# Altium schematic sheet Power_Card.SchDoc
size Letter; SheetNumber: 1; SheetTotal: 4
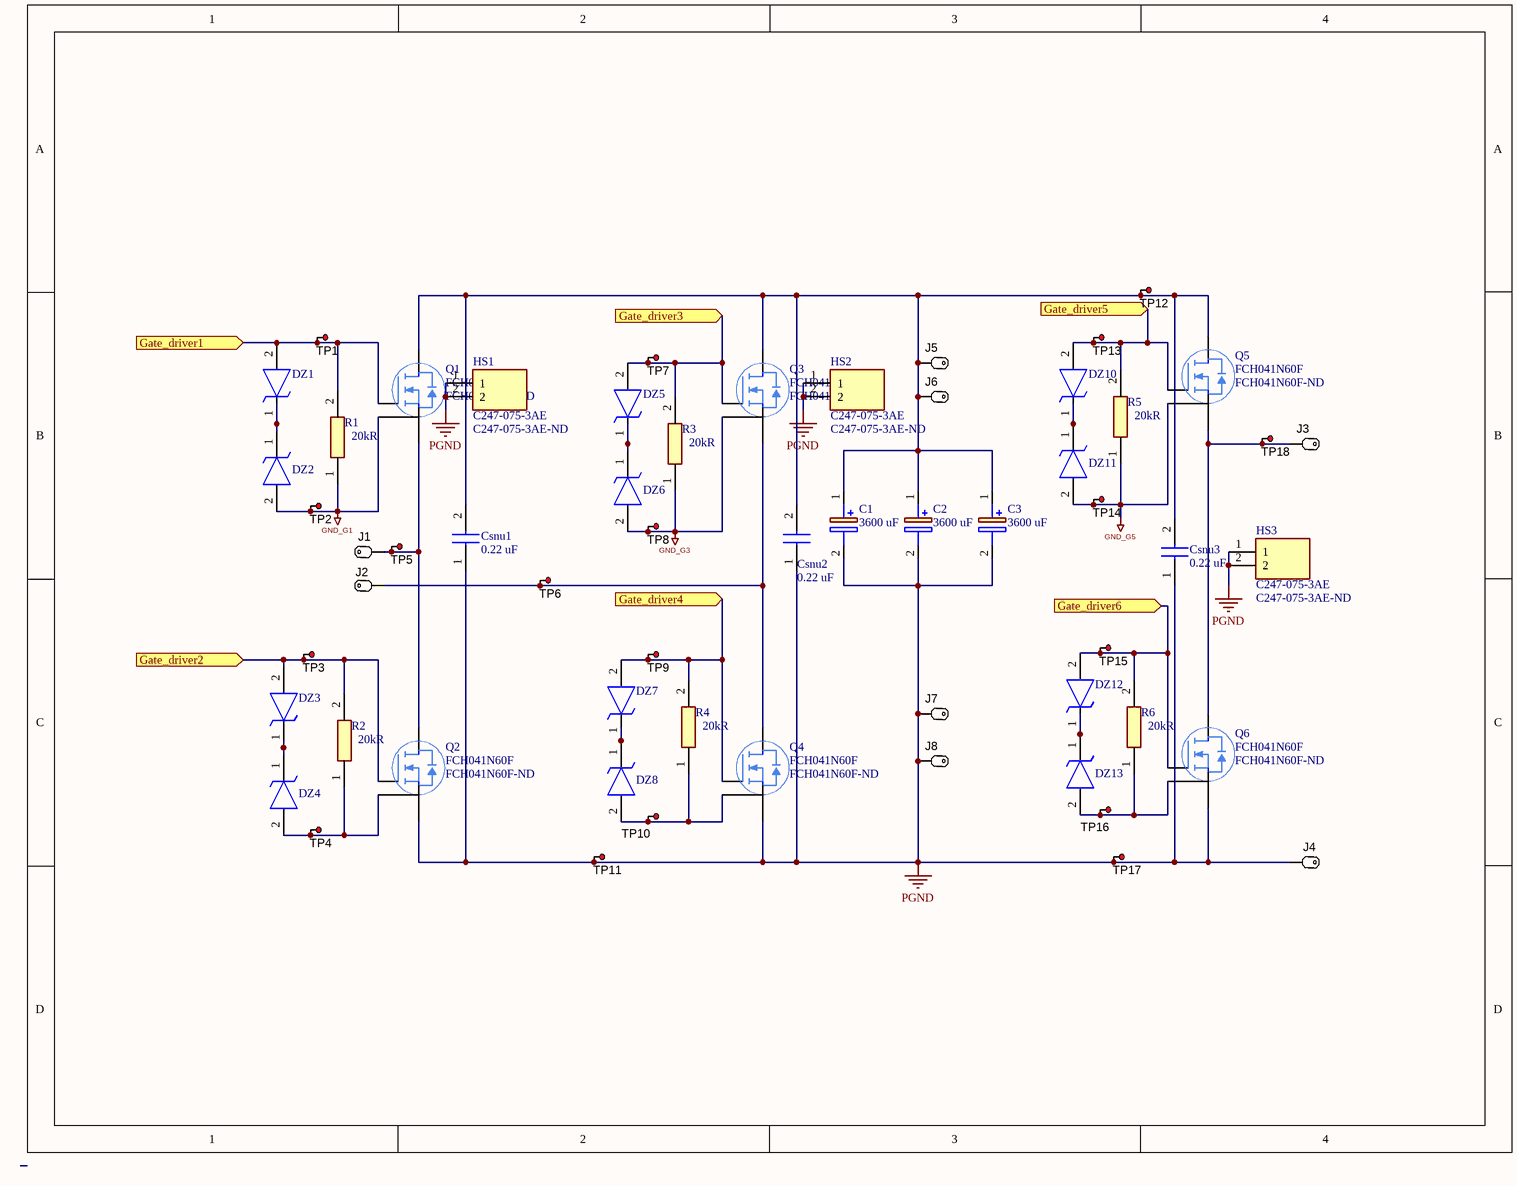
[diagram p0: Power_Card.SchDoc]

## Parts
C1  3600 uF  [CAPPRD2220W900D5400H8200]
C2  3600 uF  [CAPPRD2220W900D5400H8200]
C3  3600 uF  [CAPPRD2220W900D5400H8200]
Csnu1  0.22 uF  [224PPB250K]
Csnu2  0.22 uF  [224PPB250K]
Csnu3  0.22 uF  [224PPB250K]
DZ1  SMA6J5.0A  [DIOM5026X229N]  (value not drawn)
DZ2  SMA6J5.0A  [DIOM5026X229N]  (value not drawn)
DZ3  SMA6J5.0A  [DIOM5026X229N]  (value not drawn)
DZ4  SMA6J5.0A  [DIOM5026X229N]  (value not drawn)
DZ5  SMA6J5.0A  [DIOM5026X229N]  (value not drawn)
DZ6  SMA6J5.0A  [DIOM5026X229N]  (value not drawn)
DZ7  SMA6J5.0A  [DIOM5026X229N]  (value not drawn)
DZ8  SMA6J5.0A  [DIOM5026X229N]  (value not drawn)
DZ10  SMA6J5.0A  [DIOM5026X229N]  (value not drawn)
DZ11  SMA6J5.0A  [DIOM5026X229N]  (value not drawn)
DZ12  SMA6J5.0A  [DIOM5026X229N]  (value not drawn)
DZ13  SMA6J5.0A  [DIOM5026X229N]  (value not drawn)
HS1  C247-075-3AE  Supplier Part Number 1: C247-075-3AE-ND  [C2470753AE]
HS2  C247-075-3AE  Supplier Part Number 1: C247-075-3AE-ND  [C2470753AE]
HS3  C247-075-3AE  Supplier Part Number 1: C247-075-3AE-ND  [C2470753AE]
J1  (no value)  [TE_62409-1]
J2  (no value)  [TE_62409-1]
J3  (no value)  [TE_62409-1]
J4  (no value)  [TE_62409-1]
J5  (no value)  [TE_62409-1]
J6  (no value)  [TE_62409-1]
J7  (no value)  [TE_62409-1]
J8  (no value)  [TE_62409-1]
Q1  FCH041N60F  Supplier Part Number 1: FCH041N60F-ND  [TO-247-4L_FCH041N60F]
Q2  FCH041N60F  Supplier Part Number 1: FCH041N60F-ND  [TO-247-4L_FCH041N60F]
Q3  FCH041N60F  Supplier Part Number 1: FCH041N60F-ND  [TO-247-4L_FCH041N60F]
Q4  FCH041N60F  Supplier Part Number 1: FCH041N60F-ND  [TO-247-4L_FCH041N60F]
Q5  FCH041N60F  Supplier Part Number 1: FCH041N60F-ND  [TO-247-4L_FCH041N60F]
Q6  FCH041N60F  Supplier Part Number 1: FCH041N60F-ND  [TO-247-4L_FCH041N60F]
R1  Resistance: 20kR  [RESC3216X70N]
R2  Resistance: 20kR  [RESC3216X70N]
R3  Resistance: 20kR  [RESC3216X70N]
R4  Resistance: 20kR  [RESC3216X70N]
R5  Resistance: 20kR  [RESC3216X70N]
R6  Resistance: 20kR  [RESC3216X70N]
TP1  5010  [Keystone5010]  (value not drawn)
TP2  5010  [Keystone5010]  (value not drawn)
TP3  5010  [Keystone5010]  (value not drawn)
TP4  5010  [Keystone5010]  (value not drawn)
TP5  5010  [Keystone5010]  (value not drawn)
TP6  5010  [Keystone5010]  (value not drawn)
TP7  5010  [Keystone5010]  (value not drawn)
TP8  5010  [Keystone5010]  (value not drawn)
TP9  5010  [Keystone5010]  (value not drawn)
TP10  5010  [Keystone5010]  (value not drawn)
TP11  5010  [Keystone5010]  (value not drawn)
TP12  5010  [Keystone5010]  (value not drawn)
TP13  5010  [Keystone5010]  (value not drawn)
TP14  5010  [Keystone5010]  (value not drawn)
TP15  5010  [Keystone5010]  (value not drawn)
TP16  5010  [Keystone5010]  (value not drawn)
TP17  5010  [Keystone5010]  (value not drawn)
TP18  5010  [Keystone5010]  (value not drawn)

## Ports
Gate_driver1 (in), Gate_driver2 (in), Gate_driver3 (in), Gate_driver4 (in), Gate_driver5 (in), Gate_driver6 (in)

## Nets
GND_G1: DZ2.2(A) Q1.3(S) R1.1 TP2.1
GND_G3: DZ6.2(A) Q3.3(S) R3.1 TP8.1
GND_G5: DZ11.2(A) Q5.3(S) R5.1 TP14.1
PGND: C1.2(-) C2.2(-) C3.2(-) Csnu1.1 Csnu2.1 Csnu3.1 HS1.1 HS1.2 HS2.1 HS2.2 HS3.1 HS3.2 J4.1(P1) J7.1(P1) J8.1(P1) Q2.2(Power_Source) Q4.2(Power_Source) Q6.2(Power_Source) TP11.1 TP17.1
Gate_driver1: DZ1.2(A) Q1.4(G) R1.2 TP1.1 ; port Gate_driver1
Gate_driver2: DZ3.2(A) Q2.4(G) R2.2 TP3.1 ; port Gate_driver2
Gate_driver3: DZ5.2(A) Q3.4(G) R3.2 TP7.1 ; port Gate_driver3
Gate_driver4: DZ7.2(A) Q4.4(G) R4.2 TP9.1 ; port Gate_driver4
Gate_driver5: DZ10.2(A) Q5.4(G) R5.2 TP13.1 ; port Gate_driver5
Gate_driver6: DZ12.2(A) Q6.4(G) R6.2 TP15.1 ; port Gate_driver6
NetC1_1: C1.1(+) C2.1(+) C3.1(+) Csnu1.2 Csnu2.2 Csnu3.2 J5.1(P1) J6.1(P1) Q1.1(D) Q3.1(D) Q5.1(D) TP12.1
NetDZ1_1: DZ1.1(K) DZ2.1(K)
NetDZ3_1: DZ3.1(K) DZ4.1(K)
NetDZ4_2: DZ4.2(A) Q2.3(S) R2.1 TP4.1
NetDZ5_1: DZ5.1(K) DZ6.1(K)
NetDZ7_1: DZ7.1(K) DZ8.1(K)
NetDZ8_2: DZ8.2(A) Q4.3(S) R4.1 TP10.1
NetDZ10_1: DZ10.1(K) DZ11.1(K)
NetDZ12_1: DZ12.1(K) DZ13.1(K)
NetDZ13_2: DZ13.2(A) Q6.3(S) R6.1 TP16.1
NetJ1_1: J1.1(P1) Q1.2(Power_Source) Q2.1(D) TP5.1
NetJ2_1: J2.1(P1) Q3.2(Power_Source) Q4.1(D) TP6.1
NetJ3_1: J3.1(P1) Q5.2(Power_Source) Q6.1(D) TP18.1

## Library data of the parts
C1-C3 = ALS70A362KE250: Capacitor Polarised; Manufacturer_Name: Kemet; Datasheet Link: https://www.mouser.co.cr/ProductDetail/KEMET/ALS70A362KE250?qs=%2Fha2pyFaduj3AQ8COxkE8lI%252BUillJnwqd3tsmY5wFt8h31rq7v%2FTZw%3D%3D; Height: 82mm; Manufacturer_Part_Number: ALS70A362KE250
Csnu1-Csnu3 = 224PPB250K: CAP FILM 0.22UF 10% 250VDC RAD; Manufacturer_Name: ILLINOIS CAPACITOR; Manufacturer: CDE Illinois Capacitor; Dielectric Material: PP; Capacitance: 220nF; Voltage Rating (DC): 250V; Voltage Rating (AC): 160V; Datasheet Link: https://componentsearchengine.com/Datasheets/1/224PPB250K.pdf; Height: 15mm; Manufacturer_Part_Number: 224PPB250K; Mouser Part Number: 598-224PPB250K; Mouser Price/Stock: https://www.mouser.com/Search/Refine.aspx?Keyword=598-224PPB250K; Supplier 1: Digi-Key; Supplier Part Number 1: 1572-1375-ND; Manufacturer Part Number: 224PPB250K; RoHS: Yes; Category: Film Capacitors; Stock 1: 173; Pricing 1: 1=1.84000, 10=1.44900, 50=1.25580, 100=1.08680, 500=0.82110, 1000=0.72450, 2500=0.67620, 5000=0.65205 (USD); Mount: Through Hole,PCB; Case/Package: Radial; Min Operating Temperature: -55°C; Max Operating Temperature: 105°C; Tolerance: 10%; Voltage Rating: 250V; Packaging: Bulk; Termination: PC Pins; Series: PPB; Length: 1.043inch; Width: 0.236inch; Height - Seated (Max): 0.591inch; Lead Pitch: 0.886inch; Lead Free: Lead Free; ComponentLink1URL: https://datasheet.ciiva.com/23627/1658054-23627330.pdf?src-supplier=Newark; ComponentLink1Description: https://datasheet.ciiva.com/23627/1658054-23627330.pdf?src-supplier=Newark; ComponentLink2URL: https://datasheet.ciiva.com/16310/ppb-16310486.pdf?src-supplier=Future+Electronics; ComponentLink2Description: https://datasheet.ciiva.com/16310/ppb-16310486.pdf?src-supplier=Future+Electronics
DZ1-DZ8 DZ10-DZ13 = SMA6J5.0A: NEXPERIA - BZV55-C15,115 - ZENER-DIODE, 15V, 0.5W, SOD-80C-2; Manufacturer_Name: LITTELFUSE; Datasheet Link: https://www.arrow.com/en/products/sma6j5.0a/littelfuse; Height: 2.29mm; Manufacturer_Part_Number: SMA6J5.0A; Supplier 1: Digi-Key; Manufacturer: Nexperia; Manufacturer Part Number: BZV55-C15,115; RoHS: Yes; Category: Zener Diodes; Stock 1: 165; Pricing 1: 1=0.19000, 10=0.17500, 100=0.09520, 500=0.05856, 1000=0.03993 (USD); RoHS Compliant: Yes; ComponentLink1URL: http://www.farnell.com/datasheets/1498690.pdf?src-supplier=Farnell; ComponentLink1Description: http://www.farnell.com/datasheets/1498690.pdf?src-supplier=Farnell; ComponentLink2URL: https://assets.nexperia.com/documents/data-sheet/BZV55_SER.pdf?src-supplier=Digi-Key; ComponentLink2Description: https://assets.nexperia.com/documents/data-sheet/BZV55_SER.pdf?src-supplier=Digi-Key; Supplier Part Number 1: 1727-4962-1-ND
HS1-HS3 = C247-075-3AE: Heatsink,  TO-247,  75 x 20.47 x 38mm,  Spring Clip Mount; Manufacturer_Name: Ohmite; Shape: Fins,Rectangular; Finish: Anodized; Thermal Resistance @ Forced Air Flow (100 LFM): 2°C/W; Datasheet Link: https://www.ohmite.com/assets/docs/sink_c.pdf; Height: 38mm; Manufacturer_Part_Number: C247-075-3AE; Supplier 1: Digi-Key; Manufacturer: Ohmite; Manufacturer Part Number: C247-075-3AE; RoHS: Yes; Category: Heat Sinks; Stock 1: 277; Pricing 1: 1=10.28000, 10=9.99900, 25=9.44360, 50=8.88800, 100=8.33250, 250=7.77700, 500=7.22150, 1000=7.08262 (USD); Mount: PC Pin,Board,Clip; Case/Package: TO-247; Weight: 1.6oz; Package Cooled: TO-247; Material: Aluminium; Color: Black; Packaging: Bulk; Package Quantity: 5; Type: Passive; Termination: Radial; Natural Thermal Resistance: 2°C/W; Series: C; Length: 75mm; Width: 1.5inch; Height Off Base: 0.71inch; REACH SVHC: Unknown; RoHS Compliant: Yes; ComponentLink1URL: https://datasheet.ciiva.com/1347/1491991-1347537.pdf?src-supplier=Element14; ComponentLink1Description: https://datasheet.ciiva.com/1347/1491991-1347537.pdf?src-supplier=Element14; ComponentLink2URL: https://datasheet.ciiva.com/30237/c-sink-30237933.pdf?src-supplier=Onlinecomponents.com; ComponentLink2Description: https://datasheet.ciiva.com/30237/c-sink-30237933.pdf?src-supplier=Onlinecomponents.com; ComponentLink3URL: https://datasheet.ciiva.com/16151/c-sink-16151064.pdf?src-supplier=Onlinecomponents.com; ComponentLink3Description: https://datasheet.ciiva.com/16151/c-sink-16151064.pdf?src-supplier=Onlinecomponents.com; ComponentLink4URL: https://datasheet.ciiva.com/14543/70024778-14543773.pdf?src-supplier=Allied+Electronics; ComponentLink4Description: https://datasheet.ciiva.com/14543/70024778-14543773.pdf?src-supplier=Allied+Electronics
J1-J8 = 62409-1: Quick Disconnect Terminal M 15.8mm 7.5mm Tin Over Copper Automotive Bag; Manufacturer: AMP - TE CONNECTIVITY; Supplier 1: Digi-Key; Supplier Part Number 1: A24742-ND; Manufacturer Part Number: 62409-1; RoHS: No; Stock 1: 8729; Pricing 1: 1=0,19000, 10=0,17800, 25=0,15200, 50=0,13320, 100=0,12360, 250=0,10936, 750=0,09035, 1500=0,08083, 8000=0,06895 (USD); ComponentLink1URL: http://www.farnell.com/datasheets/1650963.pdf?src-supplier=Farnell; ComponentLink1Description: http://www.farnell.com/datasheets/1650963.pdf?src-supplier=Farnell; ComponentLink2URL: http://www.farnell.com/datasheets/1650963.pdf?src-supplier=Element14; ComponentLink2Description: http://www.farnell.com/datasheets/1650963.pdf?src-supplier=Element14; ComponentLink3URL: http://www.farnell.com/datasheets/1650963.pdf?src-supplier=Newark; ComponentLink3Description: http://www.farnell.com/datasheets/1650963.pdf?src-supplier=Newark; ComponentLink4URL: https://www.te.com/commerce/DocumentDelivery/DDEController?Action=srchrtrv&DocNm=62409&DocType=Customer+Drawing&DocLang=English&src-supplier=Digi-Key; ComponentLink4Description: https://www.te.com/commerce/DocumentDelivery/DDEController?Action=srchrtrv&DocNm=62409&DocType=Customer+Drawing&DocLang=English&src-supplier=Digi-Key
Q1-Q6 = FCH041N60F: MOSFET 600V N-Channel MOSFET, FRFET; Manufacturer: ON Semiconductor / Fairchild; Continuous Drain Current (ID): 76A; Rds On Max: 41mR; Input Capacitance: 14.365nF; Rise Time: 66ns; Max Power Dissipation: 595W; Fall Time: 53ns; Gate to Source Voltage (Vgs): 20V; Turn-Off Delay Time: 244ns; Turn-On Delay Time: 63ns; Element Configuration: Single; Drain to Source Resistance: 36mR; Number of Elements: 1; ComponentLink3URL: https://datasheet.ciiva.com/28425/fch041n60f-28425574.pdf?src-supplier=Avnet+Europe; ComponentLink3Description: https://datasheet.ciiva.com/28425/fch041n60f-28425574.pdf?src-supplier=Avnet+Europe; Supplier 1: Digi-Key; Manufacturer Part Number: FCH041N60F; RoHS: Yes; Category: MOSFETs; Stock 1: 1157; Pricing 1: 1=9.07000, 10=8.19600, 25=7.81480, 100=6.78560, 500=6.06480 (USD); Mount: Through Hole; Case/Package: TO-247-3; Number of Pins: 3; Weight: 6.39g; Contact Plating: Tin,Matte; Min Operating Temperature: -55°C; Max Operating Temperature: 150°C; Packaging: Rail/Tube; Drain to Source Voltage (Vdss): 600V; Package Quantity: 30; Drain to Source Breakdown Voltage: 600V; Power Dissipation: 595W; Polarity: N-CHANNEL; Series: SuperFETII®; Length: 15.87mm; Width: 4.82mm; Height: 20.82mm; Radiation Hardening: No; Lead Free: Lead Free; RoHS Compliant: Yes; ComponentLink1URL: https://datasheet.ciiva.com/15043/fch041n60f-15043778.pdf?src-supplier=Digi-Key; ComponentLink1Description: https://datasheet.ciiva.com/15043/fch041n60f-15043778.pdf?src-supplier=Digi-Key; ComponentLink2URL: https://datasheet.ciiva.com/13058/fch041n60f-226495-13058758.pdf?src-supplier=Mouser; ComponentLink2Description: https://datasheet.ciiva.com/13058/fch041n60f-226495-13058758.pdf?src-supplier=Mouser
R1-R6 = RMCF1206JT20K0‎‎: RES SMD 20K OHM 5% 1/4W 1206; Manufacturer_Name: KOA Speer; Manufacturer_Part_Number: RN73H2BTTD1001B10; Manufacturer: Stackpole Electronics; Power Rating: 250mW; Temperature Coefficient: 200ppm/°C; Datasheet Link: https://www.mouser.de/datasheet/2/219/RN73H-1843478.pdf; Height: 0.7mm; Supplier 1: Digi-Key; Manufacturer Part Number: RMCF1206JT20K0; RoHS: Yes; Category: Chip SMD Resistors; Stock 1: 60988; Pricing 1: 1=0.10000, 10=0.02800, 100=0.01150, 1000=0.00518, 2500=0.00450 (USD); Mount: Surface Mount; Case/Package: 1206; Case Code (Metric): 3216; Case Code (Imperial): 1206; Contact Plating: Tin,Matte; Size Code: 1206; Min Operating Temperature: -55°C; Max Operating Temperature: 155°C; Tolerance: 5%; Packaging: Tape and Reel; Resistor Type: Thick Film; Number of Terminations: 2; Max Power Dissipation: 250mW; Features: Automotive AEC-Q200; Series: RMCF; Length: 0.126inch; Width: 0.063inch; Radiation Hardening: No; Lead Free: Lead Free; RoHS Compliant: Yes; ComponentLink1URL: http://components.arrow.com/part/dataview/43746691S7171900N1174?src-supplier=Arrow+Electronics; ComponentLink1Description: http://components.arrow.com/part/dataview/43746691S7171900N1174?src-supplier=Arrow+Electronics; ComponentLink2URL: https://www.seielect.com/catalog/SEI-RMCF_RMCP.pdf?src-supplier=Avnet; ComponentLink2Description: https://www.seielect.com/catalog/SEI-RMCF_RMCP.pdf?src-supplier=Avnet; ComponentLink3URL: https://www.seielect.com/Catalog/SEI-RMCF_RMCP.pdf?src-supplier=Digi-Key; ComponentLink3Description: https://www.seielect.com/Catalog/SEI-RMCF_RMCP.pdf?src-supplier=Digi-Key; ComponentLink4URL: https://www.seielect.com/catalog/SEI-Packaging.pdf?src-supplier=Digi-Key; ComponentLink4Description: https://www.seielect.com/catalog/SEI-Packaging.pdf?src-supplier=Digi-Key; ComponentLink5URL: http://www.seielect.com/Catalog/SEI-RMC.pdf?src-supplier=Future+Electronics; ComponentLink5Description: http://www.seielect.com/Catalog/SEI-RMC.pdf?src-supplier=Future+Electronics; Supplier Part Number 1: RMCF1206JT20K0CT-ND
TP1-TP18 = 5010: Test Point, Multipurpose, Red, TH; Manufacturer: Keystone; CompType: Test Point Loop; ContactFinish: Silver; SymbolVersion: 2008-04-04; PartNumber: 5010; PackageReference: Red Multipurpose Testpoint; RoHS: Y; MountType: TH; ComponentLink1Description: Datasheet URL; ComponentLink1URL: http://www.keyelco.com/userAssets/file/M60-2p60.pdf; Color: Red; Publisher: Texas Instruments; LatestRevisionDate: 2016-02-11; Supplier 1: Digi-Key; Supplier Part Number 1: 36-5010-ND; Supplier 2: Mouser; Supplier Part Number 2: 534-5010